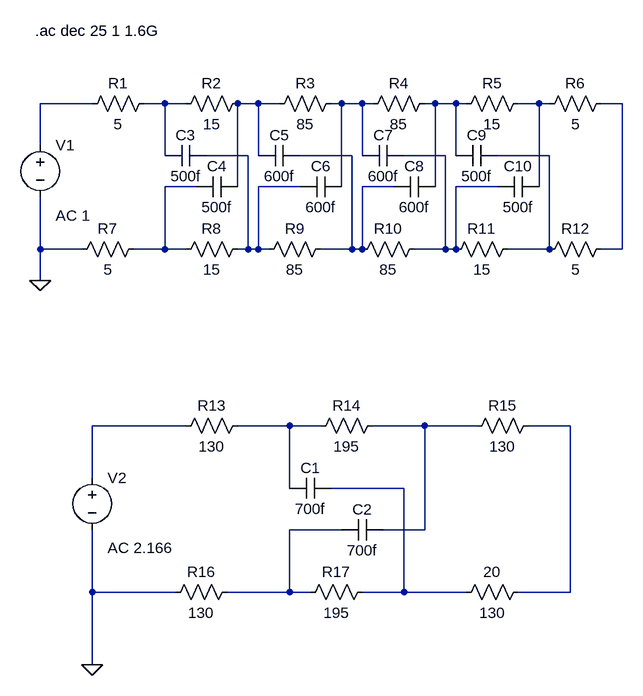
[diagram p0: schematic 4xRC_lattice.asc]
4xRC_lattice.asc, the LTspice schematic file:
Version 4
SHEET 1 1712 964
WIRE -32 80 -112 80
WIRE 80 80 48 80
WIRE 112 80 80 80
WIRE 224 80 192 80
WIRE 256 80 224 80
WIRE 352 80 336 80
WIRE 384 80 352 80
WIRE 400 80 384 80
WIRE 496 80 480 80
WIRE 528 80 496 80
WIRE 544 80 528 80
WIRE 656 80 624 80
WIRE 672 80 656 80
WIRE 784 80 752 80
WIRE -112 144 -112 80
WIRE 80 160 80 80
WIRE 208 160 144 160
WIRE 224 160 224 80
WIRE 368 160 288 160
WIRE 384 160 384 80
WIRE 512 160 448 160
WIRE 528 160 528 80
WIRE 672 160 592 160
WIRE 128 208 80 208
WIRE 192 208 192 80
WIRE 288 208 224 208
WIRE 352 208 352 80
WIRE 432 208 384 208
WIRE 496 208 496 80
WIRE 592 208 528 208
WIRE 656 208 656 80
WIRE -112 304 -112 224
WIRE -48 304 -112 304
WIRE 80 304 80 208
WIRE 80 304 32 304
WIRE 112 304 80 304
WIRE 208 304 208 160
WIRE 208 304 192 304
WIRE 224 304 224 208
WIRE 224 304 208 304
WIRE 240 304 224 304
WIRE 368 304 368 160
WIRE 368 304 320 304
WIRE 384 304 384 208
WIRE 384 304 368 304
WIRE 512 304 512 160
WIRE 512 304 464 304
WIRE 528 304 528 208
WIRE 528 304 512 304
WIRE 672 304 672 160
WIRE 672 304 608 304
WIRE 784 304 784 80
WIRE 784 304 752 304
WIRE -112 352 -112 304
WIRE 112 576 -32 576
WIRE 272 576 192 576
WIRE 320 576 272 576
WIRE 480 576 400 576
WIRE 560 576 480 576
WIRE 704 576 640 576
WIRE -32 656 -32 576
WIRE 272 672 272 576
WIRE 448 672 336 672
WIRE 352 736 272 736
WIRE 480 736 480 576
WIRE 480 736 416 736
WIRE -32 832 -32 736
WIRE 96 832 -32 832
WIRE 272 832 272 736
WIRE 272 832 176 832
WIRE 304 832 272 832
WIRE 448 832 448 672
WIRE 448 832 384 832
WIRE 544 832 448 832
WIRE 704 832 704 576
WIRE 704 832 624 832
WIRE -32 944 -32 832
FLAG -112 352 0
FLAG -32 944 0
SYMBOL res 64 64 R90
WINDOW 0 0 56 VBottom 2
WINDOW 3 32 56 VTop 2
SYMATTR InstName R1
SYMATTR Value 5
SYMBOL res 208 64 R90
WINDOW 0 0 56 VBottom 2
WINDOW 3 32 56 VTop 2
SYMATTR InstName R2
SYMATTR Value 15
SYMBOL res 352 64 R90
WINDOW 0 0 56 VBottom 2
WINDOW 3 32 56 VTop 2
SYMATTR InstName R3
SYMATTR Value 85
SYMBOL res 496 64 R90
WINDOW 0 0 56 VBottom 2
WINDOW 3 32 56 VTop 2
SYMATTR InstName R4
SYMATTR Value 85
SYMBOL res 640 64 R90
WINDOW 0 0 56 VBottom 2
WINDOW 3 32 56 VTop 2
SYMATTR InstName R5
SYMATTR Value 15
SYMBOL res 768 64 R90
WINDOW 0 0 56 VBottom 2
WINDOW 3 32 56 VTop 2
SYMATTR InstName R6
SYMATTR Value 5
SYMBOL res 48 288 R90
WINDOW 0 0 56 VBottom 2
WINDOW 3 32 56 VTop 2
SYMATTR InstName R7
SYMATTR Value 5
SYMBOL res 208 288 R90
WINDOW 0 0 56 VBottom 2
WINDOW 3 32 56 VTop 2
SYMATTR InstName R8
SYMATTR Value 15
SYMBOL res 336 288 R90
WINDOW 0 0 56 VBottom 2
WINDOW 3 32 56 VTop 2
SYMATTR InstName R9
SYMATTR Value 85
SYMBOL res 480 288 R90
WINDOW 0 0 56 VBottom 2
WINDOW 3 32 56 VTop 2
SYMATTR InstName R10
SYMATTR Value 85
SYMBOL res 624 288 R90
WINDOW 0 0 56 VBottom 2
WINDOW 3 32 56 VTop 2
SYMATTR InstName R11
SYMATTR Value 15
SYMBOL res 768 288 R90
WINDOW 0 0 56 VBottom 2
WINDOW 3 32 56 VTop 2
SYMATTR InstName R12
SYMATTR Value 5
SYMBOL cap 144 144 R90
WINDOW 0 0 32 VBottom 2
WINDOW 3 32 32 VTop 2
SYMATTR InstName C3
SYMATTR Value 500f
SYMBOL cap 192 192 R90
WINDOW 0 0 32 VBottom 2
WINDOW 3 32 32 VTop 2
SYMATTR InstName C4
SYMATTR Value 500f
SYMBOL cap 288 144 R90
WINDOW 0 0 32 VBottom 2
WINDOW 3 32 32 VTop 2
SYMATTR InstName C5
SYMATTR Value 600f
SYMBOL cap 352 192 R90
WINDOW 0 0 32 VBottom 2
WINDOW 3 32 32 VTop 2
SYMATTR InstName C6
SYMATTR Value 600f
SYMBOL cap 448 144 R90
WINDOW 0 0 32 VBottom 2
WINDOW 3 32 32 VTop 2
SYMATTR InstName C7
SYMATTR Value 600f
SYMBOL cap 496 192 R90
WINDOW 0 0 32 VBottom 2
WINDOW 3 32 32 VTop 2
SYMATTR InstName C8
SYMATTR Value 600f
SYMBOL cap 592 144 R90
WINDOW 0 0 32 VBottom 2
WINDOW 3 32 32 VTop 2
SYMATTR InstName C9
SYMATTR Value 500f
SYMBOL cap 656 192 R90
WINDOW 0 0 32 VBottom 2
WINDOW 3 32 32 VTop 2
SYMATTR InstName C10
SYMATTR Value 500f
SYMBOL voltage -112 128 R0
WINDOW 123 24 124 Left 2
WINDOW 39 0 0 Left 0
SYMATTR Value2 AC 1
SYMATTR InstName V1
SYMATTR Value ""
SYMBOL res 208 560 R90
WINDOW 0 0 56 VBottom 2
WINDOW 3 32 56 VTop 2
SYMATTR InstName R13
SYMATTR Value 130
SYMBOL res 416 560 R90
WINDOW 0 0 56 VBottom 2
WINDOW 3 32 56 VTop 2
SYMATTR InstName R14
SYMATTR Value 195
SYMBOL res 656 560 R90
WINDOW 0 0 56 VBottom 2
WINDOW 3 32 56 VTop 2
SYMATTR InstName R15
SYMATTR Value 130
SYMBOL res 192 816 R90
WINDOW 0 0 56 VBottom 2
WINDOW 3 32 56 VTop 2
SYMATTR InstName R16
SYMATTR Value 130
SYMBOL res 400 816 R90
WINDOW 0 0 56 VBottom 2
WINDOW 3 32 56 VTop 2
SYMATTR InstName R17
SYMATTR Value 195
SYMBOL res 640 816 R90
WINDOW 0 0 56 VBottom 2
WINDOW 3 32 56 VTop 2
SYMATTR InstName 20
SYMATTR Value 130
SYMBOL cap 336 656 R90
WINDOW 0 0 32 VBottom 2
WINDOW 3 32 32 VTop 2
SYMATTR InstName C1
SYMATTR Value 700f
SYMBOL cap 416 720 R90
WINDOW 0 0 32 VBottom 2
WINDOW 3 32 32 VTop 2
SYMATTR InstName C2
SYMATTR Value 700f
SYMBOL voltage -32 640 R0
WINDOW 123 24 124 Left 2
WINDOW 39 0 0 Left 0
SYMATTR Value2 AC 2.166
SYMATTR InstName V2
SYMATTR Value ""
TEXT -120 -32 Left 2 !.ac dec 25 1 1.6G

The netlist it stands for:
* 4xRC_lattice.asc
R1 N002 N001 5
R2 N003 N002 15
R3 N004 N003 85
R4 N005 N004 85
R5 N006 N005 15
R6 N007 N006 5
R7 N012 0 5
R8 N008 N012 15
R9 N009 N008 85
R10 N010 N009 85
R11 N011 N010 15
R12 N007 N011 5
C3 N008 N002 500f
C4 N003 N012 500f
C5 N009 N003 600f
C6 N004 N008 600f
C7 N010 N004 600f
C8 N005 N009 600f
C9 N011 N005 500f
C10 N006 N010 500f
V1 N001 0 AC 1
R13 N014 N013 130
R14 N015 N014 195
R15 N016 N015 130
R16 N018 0 130
R17 N017 N018 195
R§20 N016 N017 130
C1 N017 N014 700f
C2 N015 N018 700f
V2 N013 0 AC 2.166
.ac dec 25 1 1.6G
.backanno
.end